# EAGLE design sch (EAGLE 7.4.0)
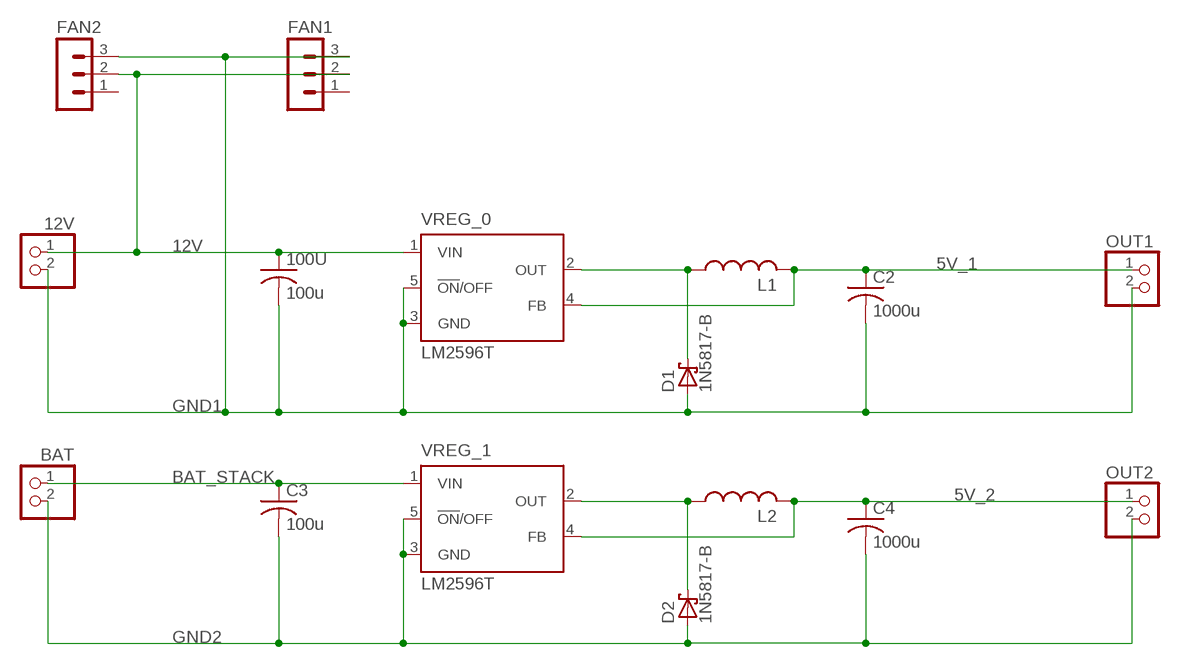
[diagram p0: schematic, sheet 1]

## Parts
12V  PINHD-1X2  [1X02]
100U  100u  C-US025-030X050  [C025-030X050]
BAT  PINHD-1X2  [1X02]
C2  1000u  C-US025-030X050  [C025-030X050]
C3  100u  C-US025-030X050  [C025-030X050]
C4  1000u  C-US025-030X050  [C025-030X050]
D1  1N5817-B  [DO41-7.6]
D2  1N5817-B  [DO41-7.6]
FAN1  MA03-1  [MA03-1]
FAN2  MA03-1  [MA03-1]
L1  L-US6000-XXX-RC  [6000-XXXX-RC]
L2  L-US6000-XXX-RC  [6000-XXXX-RC]
OUT1  PINHD-1X2  [1X02]
OUT2  PINHD-1X2  [1X02]
VREG_0  LM2596T  [T05D]
VREG_1  LM2596T  [T05D]

## Nets
5V_1: C2.1 L1.2 OUT1.1 VREG_0.4(FB)
5V_2: C4.1 L2.2 OUT2.1 VREG_1.4(FB)
12V: 12V.1 100U.1 FAN1.2 FAN2.2 VREG_0.1(VIN)
BAT_STACK: BAT.1 C3.1 VREG_1.1(VIN)
GND1: 12V.2 100U.2 C2.2 D1.A FAN1.3 FAN2.3 OUT1.2 VREG_0.3(GND) VREG_0.5(!ON!/OFF)
GND2: BAT.2 C3.2 C4.2 D2.A OUT2.2 VREG_1.3(GND) VREG_1.5(!ON!/OFF)
N$1: D1.C L1.1 VREG_0.2(OUT)
N$7: D2.C L2.1 VREG_1.2(OUT)
Unconnected: FAN1.1 FAN2.1

## Library data of the parts
12V BAT OUT1 OUT2 = pinhead:PINHD-1X2: PIN HEADER
100U C2-C4 = rcl:C-US: CAPACITOR, American symbol
D1 D2 = diode:1N581*: 1.0A SCHOTTKY BARRIER RECTIFIER Source: http://www.diodes.com/datasheets/ds23001.pdf
FAN1 FAN2 = con-lstb:MA03-1: PIN HEADER; OC_FARNELL: unknown; OC_NEWARK: unknown
L1 L2 = rcl:L-US: INDUCTOR, American symbol
VREG_0 VREG_1 = national-semiconductor:LM2596: SIMPLE SWITCHER® Power Converter 150 kHz 3A Step-Down Voltage Regulator Source: http://www.national.com/ds/LM/LM2596.pdf; MPN: LM2596T-ADJ/LF02; OC_FARNELL: 9494162; OC_NEWARK: 65K5910

## Board
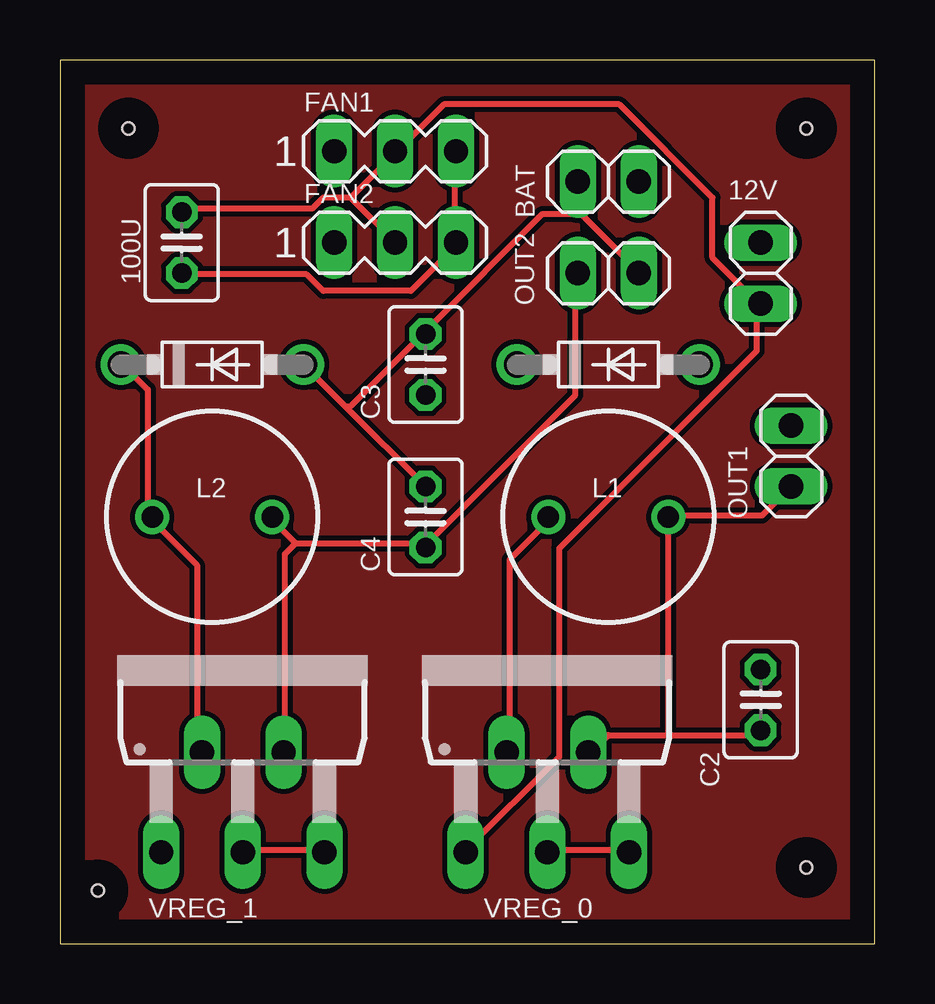
[diagram p1: board, top side]
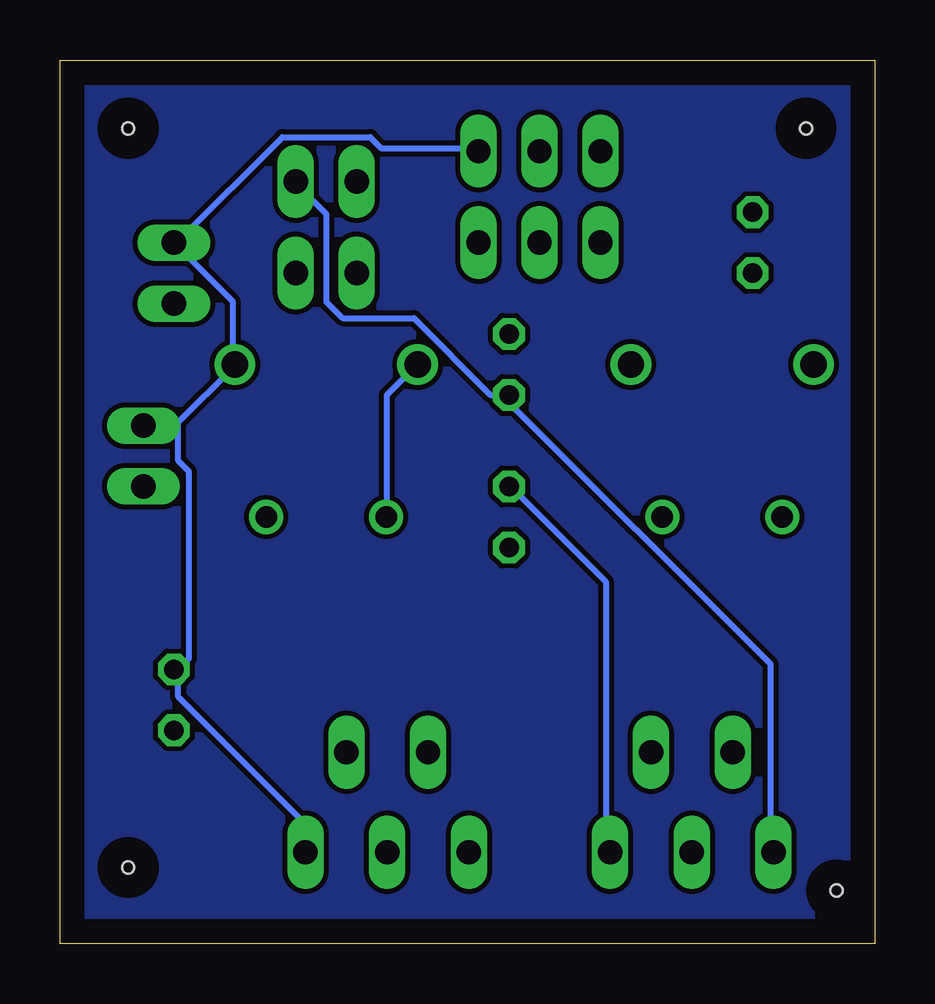
[diagram p2: board, bottom side, seen from below]

Size 33.96 x 36.82 mm. Coordinates in mm from the lower left corner, seen from the top.
Outline: 0,0 33.96,0 33.96,36.82 0,36.82 0,0
Copper layers (1*16): Top 0.035mm / dielectric 1.5mm / Bottom 0.035mm
Design rules "default": minimum track width 10mil, minimum drill 24mil, track to track 8mil, track to pad 8mil, pad to pad 8mil, via to via 8mil, smd to smd 8mil, copper to edge 40mil, drill to drill 8mil, minimum pad ring 10mil, minimum via ring 8mil, stop-mask expansion 4mil, vias tented up to drill 0mil, thermal gap 10mil
Holes 0.5 mm at 1.59,2.22 31.11,3.17 31.11,33.97 2.86,33.97

### Footprints (pad centres in the part's own frame; a part is rotated, then mirrored left to right if it is on the bottom)
1X02 = drill 1.016 long: 1 -1.27,0; 2 1.27,0
C025-030X050 = drill 0.813 octagon: 1 -1.27,0; 2 1.27,0
DO41-7.6 = drill 1.1 pad 1.7: A 3.81,0; C -3.81,0
MA03-1 = drill 1.016 long: 1 -2.54,0; 2 0,0; 3 2.54,0
6000-XXXX-RC = drill 0.9 pad 1.422: 1 -2.5,0; 2 2.5,0
T05D = drill 1.016 long: 1 -3.404,-5.08; 2 -1.702,-0.914; 3 0,-5.08; 4 1.702,-0.914; 5 3.404,-5.08

### Placement (x,y rotation side)
12V  29.21,27.94 90 top
100U  5.08,29.21 270 top
BAT  22.86,31.75 180 top
C2  29.21,10.16 90 top
C3  15.24,24.13 90 top
C4  15.24,17.78 90 top
D1  22.86,24.13 0 top
D2  6.35,24.13 0 top
FAN1  13.97,33.02 0 top
FAN2  13.97,29.21 0 top
L1  22.86,17.78 0 top
L2  6.35,17.78 0 top
OUT1  30.48,20.32 90 top
OUT2  22.86,27.94 0 top
VREG_0  20.32,8.89 0 top
VREG_1  7.62,8.89 0 top

### Tracks (layer width: path | path; a pad name or v marks a point on that pad's centre or on a via)
5V_1
  Top 0.254: OUT1.1 29.26,17.83 25.38,17.83 L1.2 25.38,17.6 25.38,8.69 | 25.38,8.69 22.86,8.69 22.17,8 VREG_0.4 | 25.38,8.69 29.03,8.69 C2.1
5V_2
  Top 0.254: 9.83,16.69 15.09,16.69 C4.1 15.32,16.69 21.49,22.86 21.49,27.89 OUT2.1 | 9.83,16.69 8.91,17.6 L2.2 | 9.83,16.69 9.37,16.23 9.37,8 VREG_1.4
12V
  Top 0.254: 12.12,31.09 10.97,31.09 10.52,30.63 5.26,30.63 100U.1 | 12.12,31.09 13.95,32.92 FAN1.2 14.17,33.15 16,34.98 23.32,34.98 27.2,31.09 27.2,28.57 29.03,26.75 12V.1 29.03,26.52 29.03,24.69 20.8,16.46 20.8,7.77 16.92,3.89 VREG_0.1 | 12.12,31.09 13.95,29.26 FAN2.2
BAT_STACK
  Bottom 0.254: 15.54,22.86 16,22.86 19.2,26.06 22.17,26.06 22.86,26.75 22.86,30.4 24,31.55 BAT.1 | 15.54,22.86 C3.1 15.32,22.86 | 15.54,22.86 4.34,11.66 4.34,3.89 VREG_1.1
GND
  pour Bottom: 0,36.83 0,0 34.29,0 34.29,36.83
  pour Top: 0,36.83 34.29,36.83 34.29,0 0,0
GND1
  Top 0.254: 100U.2 5.26,27.89 10.29,27.89 10.97,27.2 14.63,27.2 16.46,29.03 FAN2.3 16.46,29.26 16.46,32.92 FAN1.3 | VREG_0.3 20.34,3.89 23.55,3.89 VREG_0.5
  Bottom 0.254: 29.03,21.72 30.4,21.72 OUT1.2 29.03,21.72 | 29.03,21.72 26.75,24 D1.A 26.75,24.23 26.75,26.75 12V.2 29.03,29.26 24.69,33.6 21.03,33.6 20.57,33.15 16.69,33.15 FAN1.3 | 29.03,11.43 29.03,10.29 23.77,5.03 23.77,3.89 VREG_0.5 | 29.03,21.72 29.03,20.12 28.57,19.66 28.57,11.89 29.03,11.43 | 29.03,11.43 C2.2
GND2
  Top 0.254: 21.72,30.4 21.72,31.55 BAT.2 21.72,30.4 | 21.72,30.4 24,28.12 OUT2.2 | VREG_1.3 7.77,3.89 10.97,3.89 VREG_1.5 | D2.A 11.89,22.4 | 11.89,22.4 C4.2 | 11.89,22.4 12.12,22.4 15.09,25.38 C3.2 15.32,25.6 20.12,30.4 21.72,30.4
  Bottom 0.254: VREG_1.5 11.2,3.89 11.2,15.09 15.09,18.97 C4.2
N$1
  Top 0.254: VREG_0.2 18.75,8 18.75,16 20.34,17.6 L1.1
  Bottom 0.254: L1.1 20.34,17.83 20.34,22.86 19.2,24 D1.C
N$7
  Top 0.254: D2.C 2.74,24 3.66,23.09 3.66,17.83 L2.1 3.89,17.6 5.71,15.77 5.71,8 VREG_1.2